# EAGLE design CC3200_V2.0 (EAGLE 6.6.0)
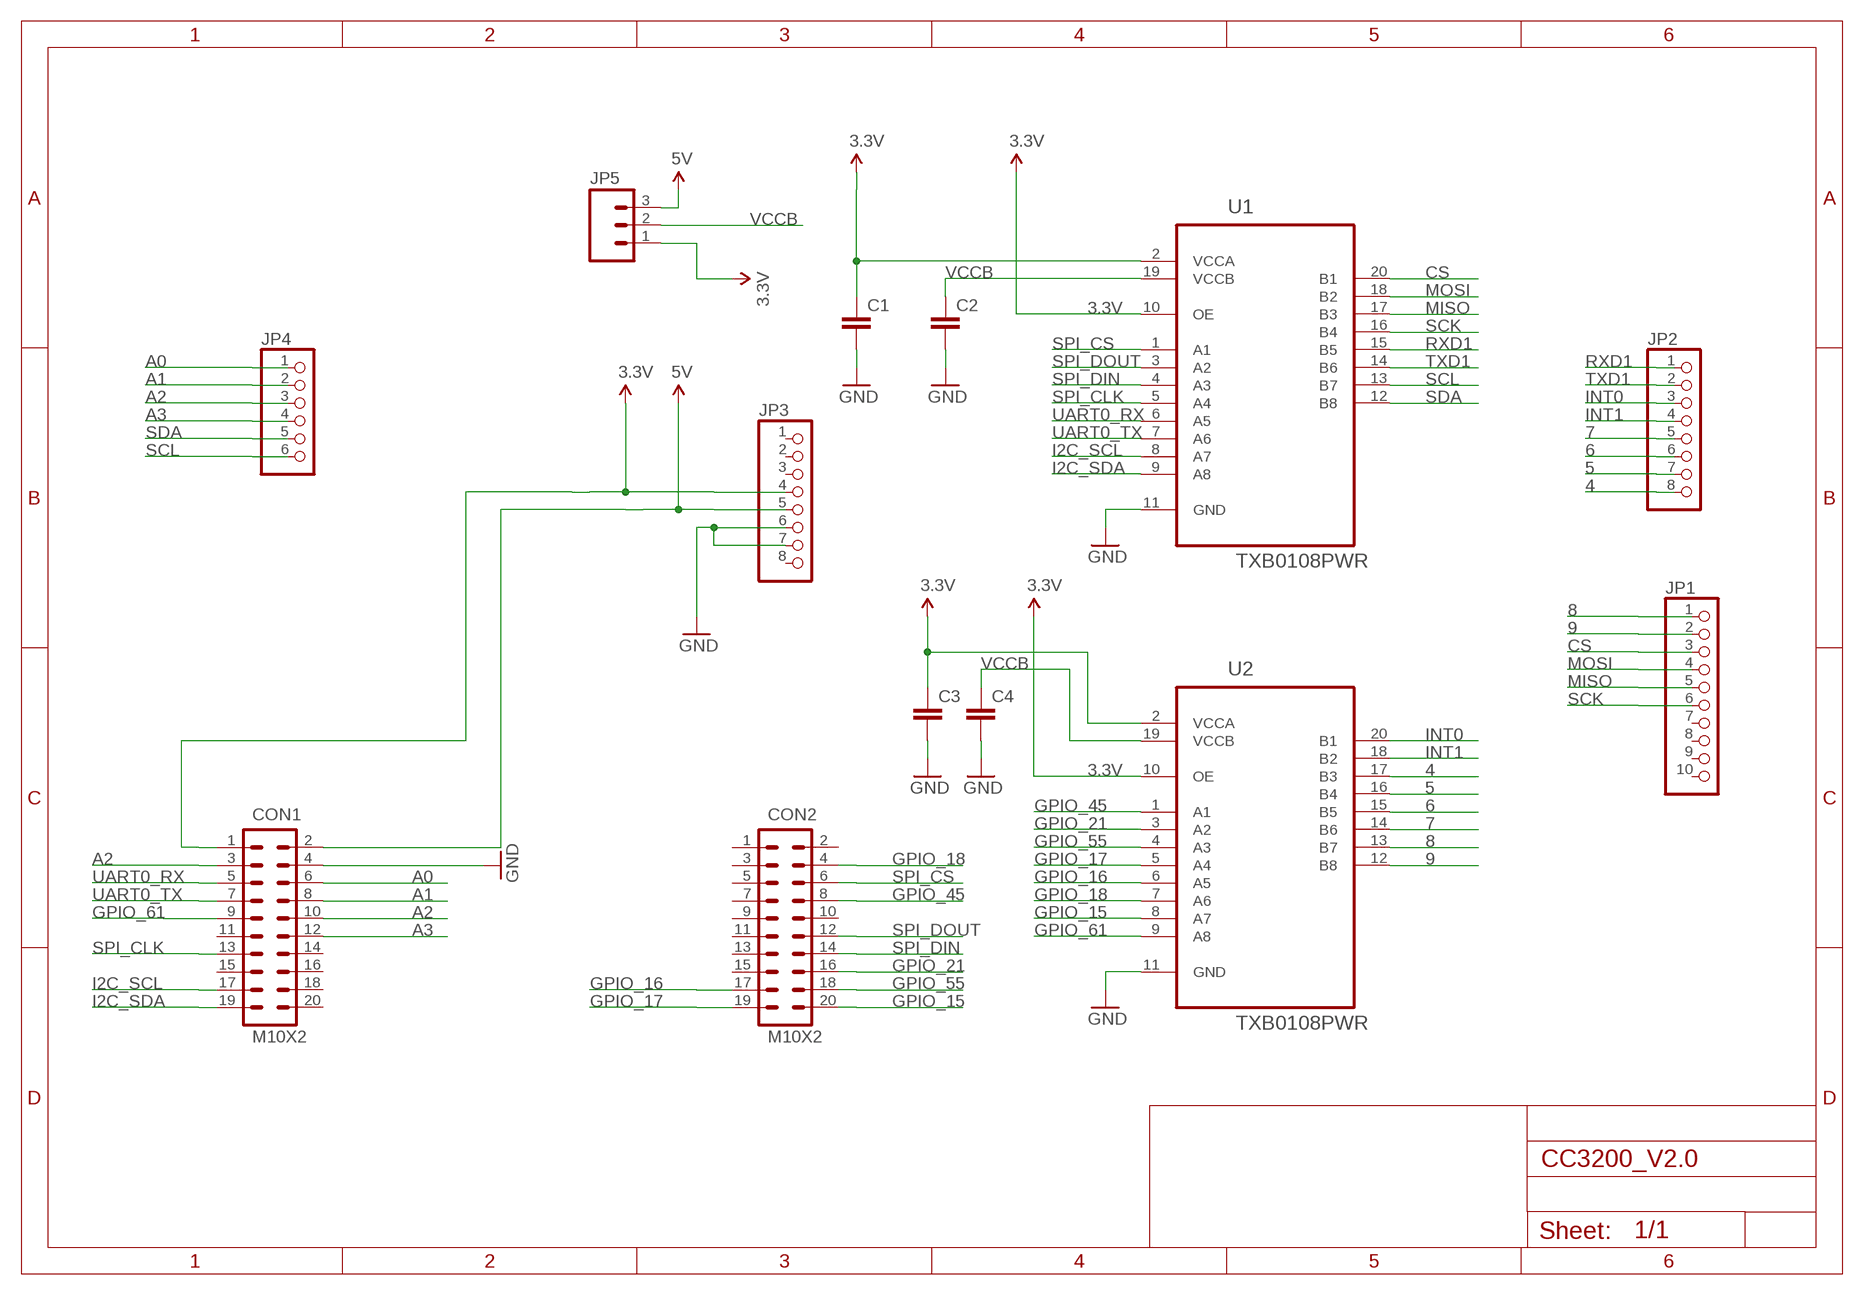
[diagram p0: schematic, sheet 1]

## Parts
C1  C-EUC0805  [C0805]
C2  C-EUC0805  [C0805]
C3  C-EUC0805  [C0805]
C4  C-EUC0805  [C0805]
CON1  M10X2  [2X10]
CON2  M10X2  [2X10]
JP1  PINHD-1X10_ARD  [1X10]
JP2  PINHD-1X8TH  [1X08-TH]
JP3  PINHD-1X8TH  [1X08-TH]
JP4  PINHD-1X6TH  [1X06-TH]
JP5  M03PTH  [1X03]
U1  TXB0108PWR  [SOP65P640X120-20N]
U2  TXB0108PWR  [SOP65P640X120-20N]

## Nets
3.3V: C1.1 C3.1 CON1.1 JP3.4 JP5.1 U1.2(VCCA) U1.10(OE) U2.2(VCCA) U2.10(OE)
4: JP2.8 U2.17(B3)
5: JP2.7 U2.16(B4)
5V: CON1.2 JP3.5 JP5.3
6: JP2.6 U2.15(B5)
7: JP2.5 U2.14(B6)
8: JP1.1 U2.13(B7)
9: JP1.2 U2.12(B8)
A0: CON1.6 JP4.1
A1: CON1.8 JP4.2
A2: CON1.3 CON1.10 JP4.3
A3: CON1.12 JP4.4
CS: JP1.3 U1.20(B1)
GND: C1.2 C2.2 C3.2 C4.2 CON1.4 JP3.6 JP3.7 U1.11(GND) U2.11(GND)
GPIO_15: CON2.20 U2.8(A7)
GPIO_16: CON2.17 U2.6(A5)
GPIO_17: CON2.19 U2.5(A4)
GPIO_18: CON2.4 U2.7(A6)
GPIO_21: CON2.16 U2.3(A2)
GPIO_45: CON2.8 U2.1(A1)
GPIO_55: CON2.18 U2.4(A3)
GPIO_61: CON1.9 U2.9(A8)
I2C_SCL: CON1.17 U1.8(A7)
I2C_SDA: CON1.19 U1.9(A8)
INT0: JP2.3 U2.20(B1)
INT1: JP2.4 U2.18(B2)
MISO: JP1.5 U1.17(B3)
MOSI: JP1.4 U1.18(B2)
RXD1: JP2.1 U1.15(B5)
SCK: JP1.6 U1.16(B4)
SCL: JP4.6 U1.13(B7)
SDA: JP4.5 U1.12(B8)
SPI_CLK: CON1.13 U1.5(A4)
SPI_CS: CON2.6 U1.1(A1)
SPI_DIN: CON2.14 U1.4(A3)
SPI_DOUT: CON2.12 U1.3(A2)
TXD1: JP2.2 U1.14(B6)
UART0_RX: CON1.5 U1.6(A5)
UART0_TX: CON1.7 U1.7(A6)
VCCB: C2.1 C4.1 JP5.2 U1.19(VCCB) U2.19(VCCB)
Unconnected: CON1.11 CON1.14 CON1.15 CON1.16 CON1.18 CON1.20 CON2.1 CON2.2 CON2.3 CON2.5 CON2.7 CON2.9 CON2.10 CON2.11 CON2.13 CON2.15 JP1.7 JP1.8 JP1.9 JP1.10 JP3.1 JP3.2 JP3.3 JP3.8

## Library data of the parts
C1-C4 = rcl:C-EU: CAPACITOR, European symbol
CON1 CON2 = SparkFun-Connectors:M10X2: This was SPECIALLY designed to be used with our Graphic LCD Backpack. Be sure you want to use this! It is not only staggered on each line of header holes, but IT IS ALSO offset of the center point of the top and bottom lines by 5 mil. This causes the headers to lock into place on the "standard" footprint on the LCD screen. The extra squares on the tdocu layer are there simply to reference other pins (if you were to actually populate a longer header than ten long - this is what we do with the backpacks).
JP1 = SmartPrj:PINHD-1X10_ARD: PIN HEADER
JP2 JP3 = SmartPrj:PINHD-1X8: PIN HEADER
JP4 = SmartPrj:PINHD-1X6: PIN HEADER
JP5 = SparkFun-Connectors:M03: Header 3 Standard 3-pin 0.1" header. Use with straight break away headers (SKU : PRT-00116), right angle break away headers (PRT-00553), swiss pins (PRT-00743), machine pins (PRT-00117), and female headers (PRT-00115). Molex polarized connector foot print use with SKU : PRT-08232 with associated crimp pins and housings.
U1 U2 = TXB0108PWR:TXB0108PWR: 8-BIT BIDIRECTIONAL VOLTAGE-LEVEL TRANSLATOR; MPN: TXB0108PWR; OC_FARNELL: 1494945; OC_NEWARK: 27M1151; PACKAGE: TSSOP-20; SUPPLIER: Texas Instruments

## Board
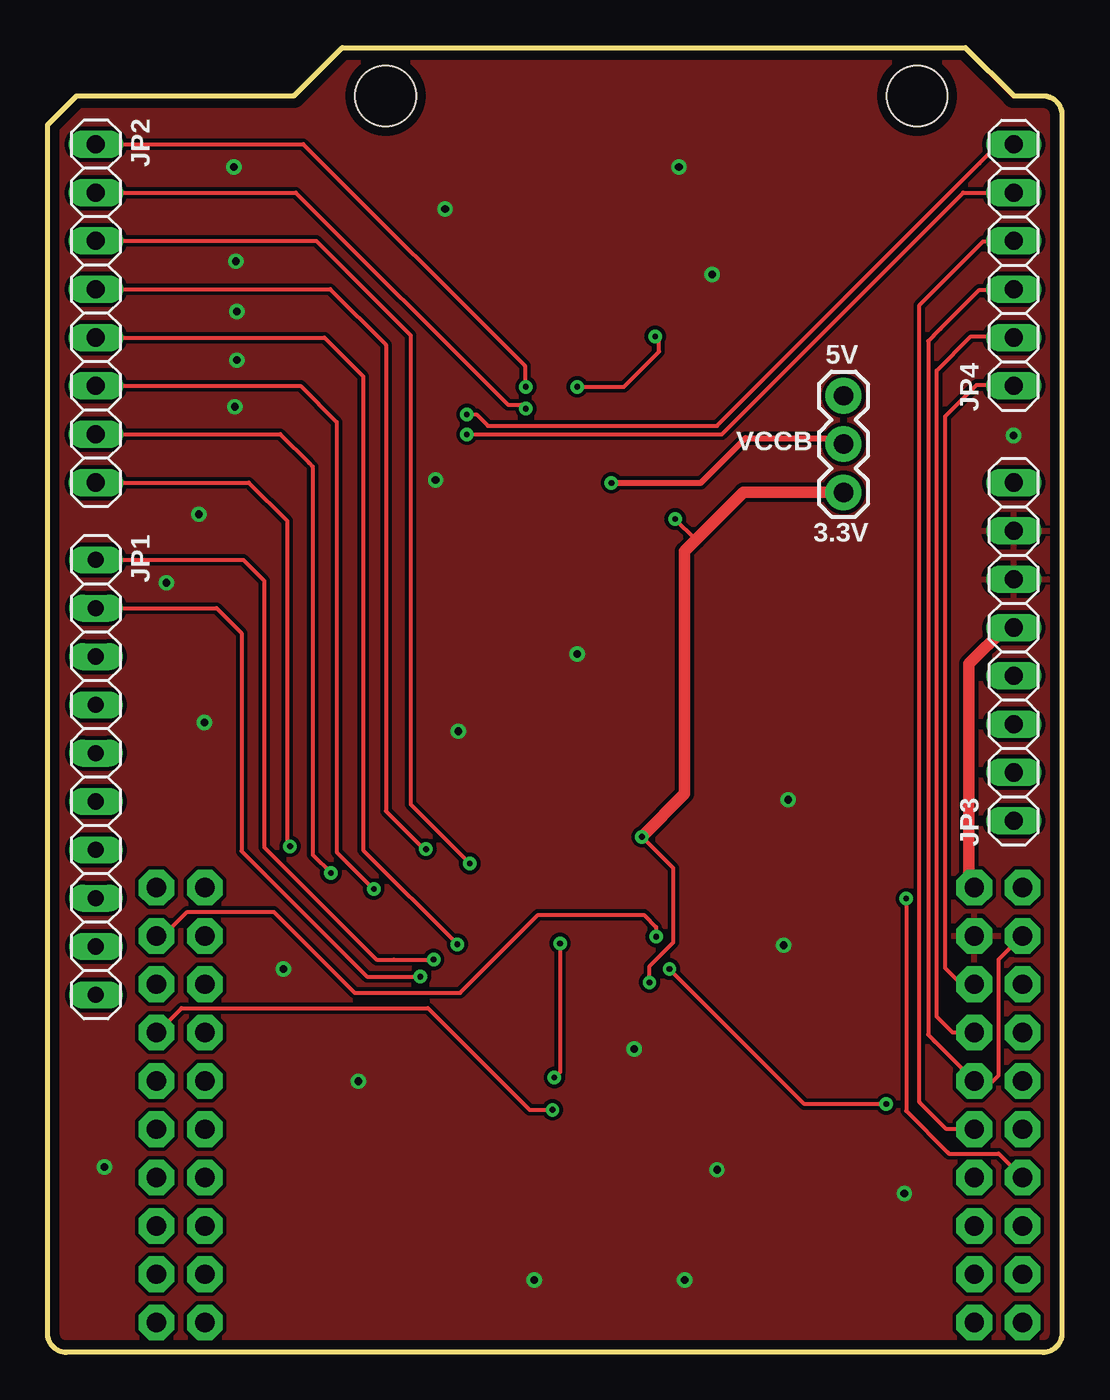
[diagram p1: board, top side]
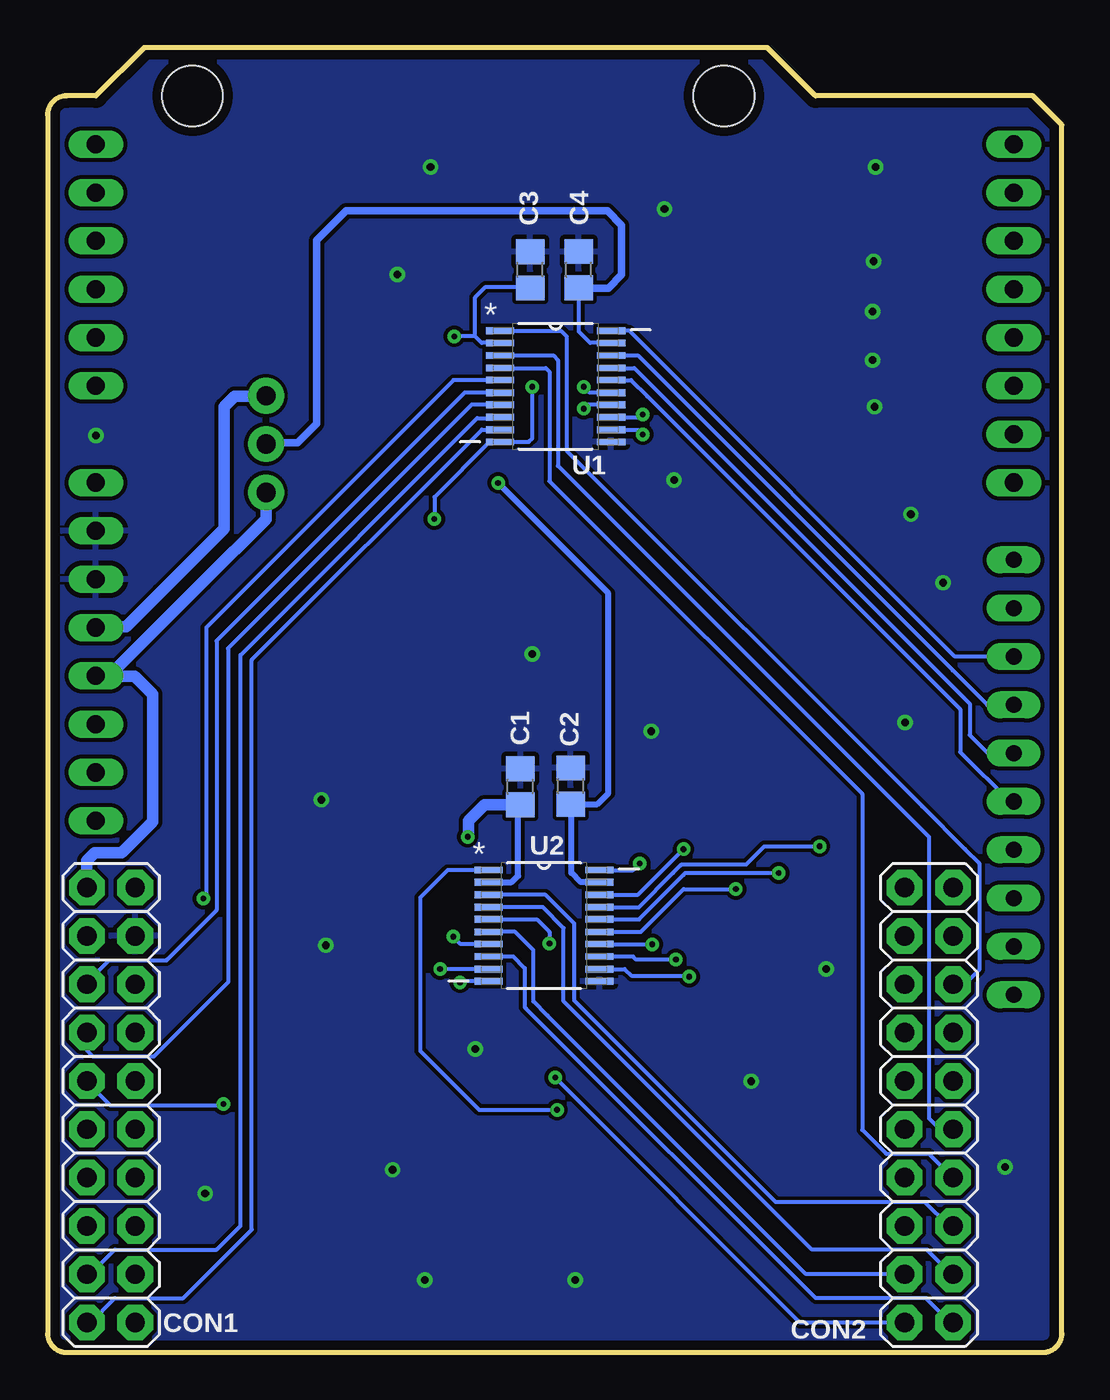
[diagram p2: board, bottom side, seen from below]

Size 53.34 x 68.58 mm. Coordinates in mm from the lower left corner, seen from the top.
Outline: 0,64.52 1.52,66.04 12.95,66.04 15.49,68.58 48.26,68.58 50.8,66.04 52.34,66.04 arc-90 53.34,65.04 53.34,1 arc-90 52.34,0 1,0 arc-90 0,1 0,64.52
Copper layers (1*16): Top 0.035mm / dielectric 1.5mm / Bottom 0.035mm
Design rules "default *": minimum track width 0.2mm, minimum drill 0.3mm, track to track 8mil, track to pad 8mil, pad to pad 8mil, via to via 8mil, smd to smd 8mil, copper to edge 0.5mm, drill to drill 0.5mm, minimum pad ring 10mil, minimum via ring 8mil, stop-mask expansion 4mil, vias tented up to drill 0mil, thermal gap 10mil
Holes 3.2 mm at 17.78,66.04 45.72,66.04

### Footprints (pad centres in the part's own frame; a part is rotated, then mirrored left to right if it is on the bottom)
C0805 = smd 1.3 x 1.5: 1 -0.95,0; 2 0.95,0
2X10 = drill 1.016 pad 1.88 octagon: 1 -11.43,-1.27; 2 -11.43,1.27; 3 -8.89,-1.27; 4 -8.89,1.27; 5 -6.35,-1.27; 6 -6.35,1.27; 7 -3.81,-1.27; 8 -3.81,1.27; 9 -1.27,-1.27; 10 -1.27,1.27; 11 1.27,-1.27; 12 1.27,1.27; 13 3.81,-1.27; 14 3.81,1.27; 15 6.35,-1.27; 16 6.35,1.27; 17 8.89,-1.27; 18 8.89,1.27; 19 11.43,-1.27; 20 11.43,1.27
1X10 = drill 0.85 pad 1.422 long: 1 -11.43,0; 2 -8.89,0; 3 -6.35,0; 4 -3.81,0; 5 -1.27,0; 6 1.27,0; 7 3.81,0; 8 6.35,0; 9 8.89,0; 10 11.43,0
1X08-TH = drill 0.95 pad 1.422 long: 1 -8.89,0; 2 -6.35,0; 3 -3.81,0; 4 -1.27,0; 5 1.27,0; 6 3.81,0; 7 6.35,0; 8 8.89,0
1X06-TH = drill 0.95 pad 1.422 long: 1 -6.35,0; 2 -3.81,0; 3 -1.27,0; 4 1.27,0; 5 3.81,0; 6 6.35,0
1X03 = drill 1.016 pad 1.88: 1 0,0; 2 2.54,0; 3 5.08,0
SOP65P640X120-20N = smd 1.473 x 0.356: 1 -2.921,2.921; 2 -2.921,2.286; 3 -2.921,1.626; 4 -2.921,0.965; 5 -2.921,0.33; 6 -2.921,-0.33; 7 -2.921,-0.965; 8 -2.921,-1.626; 9 -2.921,-2.286; 10 -2.921,-2.921; 11 2.921,-2.921; 12 2.921,-2.286; 13 2.921,-1.626; 14 2.921,-0.965; 15 2.921,-0.33; 16 2.921,0.33; 17 2.921,0.965; 18 2.921,1.626; 19 2.921,2.286; 20 2.921,2.921

### Placement (x,y rotation side)
C1  28.48,29.73 90 bottom
C2  25.83,29.77 90 bottom
C3  27.97,56.9 90 bottom
C4  25.42,56.91 90 bottom
CON1  50,13 270 bottom
CON2  7,13 270 bottom
JP1  2.54,30.23 270 top
JP2  2.54,54.61 270 top
JP3  50.8,36.83 90 top
JP4  50.8,57.15 90 top
JP5  41.85,45.2 90 top
U1  26.62,50.77 0 bottom
U2  27.24,22.43 0 bottom

### Tracks (layer width: path | path; a pad name or v marks a point on that pad's centre or on a via)
3.3V  (via drill 0.3)
  Top 0.2: 34.1,42.7 v33,43.8 | v27.85,50.75 30.3,50.75 32.15,52.6 32.15,53.2 v31.95,53.4 | v31.65,19.45 31.65,20.3 32.9,21.55 32.9,25.45 v31.25,27.1
  Top 0.61: JP5.1 36.6,45.2 34.1,42.7 33.5,42.1 33.5,29.35 v31.25,27.1
  Bottom 0.2: U1.2 30.51,53.06 30.85,53.4 | 30.85,53.4 30.85,55.45 30.3,56 28.02,56 C3.1 | v33,43.8 33,44.95 30.1,47.85 U1.10 28.05,47.85 27.85,48.05 v27.85,50.75 | 30.85,53.4 v31.95,53.4 | U2.10 31.59,19.51 v31.65,19.45
  Bottom 0.305: U2.2 28.93,24.72 28.6,25.05 28.6,28.66 C1.1
  Bottom 0.61: JP5.1 41.85,43.8 45.15,40.5 50.09,35.56 JP3.4 48.75,35.55 47.8,34.6 47.8,33.75 47.8,28.5 47.8,27.9 49.45,26.25 50.85,26.25 51.27,25.83 CON1.1 | C1.1 30.37,28.78 31.2,27.95 31.2,27.15 v31.25,27.1
4  (via drill 0.3)
  Top 0.2: JP2.8 10.58,45.72 12.6,43.7 12.6,26.75 v12.75,26.6
  Bottom 0.2: U2.17 22.25,23.4 20.45,25.2 20.05,25.6 20,25.65 16.6,25.65 15.65,26.6 v12.75,26.6
5  (via drill 0.3)
  Top 0.2: JP2.7 12.24,48.26 13.75,46.75 13.95,46.55 13.95,26.15 v14.9,25.2
  Bottom 0.2: U2.16 22.24,22.76 19.9,25.1 19.8,25.2 v14.9,25.2
5V
  Top 0.61: CON1.2 48.45,24.71 48.45,36.2 50.35,38.1 JP3.5
  Bottom 0.61: JP3.5 50.75,38.15 49.2,38.15 47.4,39.95 44.05,43.3 44.05,49.7 43.5,50.25 41.88,50.25 JP5.3
6  (via drill 0.3)
  Top 0.2: JP2.6 13.3,50.8 15.2,48.9 15.2,26.3 v17.15,24.35
  Bottom 0.2: U2.15 22.15,22.1 19.9,24.35 v17.15,24.35
7  (via drill 0.3)
  Top 0.2: JP2.5 14.56,53.34 16.6,51.3 16.6,26.4 v21.55,21.45
  Bottom 0.2: U2.14 21.57,21.47 v21.55,21.45
8  (via drill 0.3)
  Top 0.2: JP1.1 10.29,41.66 11.4,40.55 11.4,27.45 11.4,26.55 17.3,20.65 18.2,20.65 v20.3,20.65
  Bottom 0.2: v20.3,20.65 22.4,20.65 22.55,20.8 U2.13
9  (via drill 0.3)
  Top 0.2: JP1.2 8.88,39.12 10.2,37.8 10.2,26.35 16.8,19.75 v19.6,19.75
  Bottom 0.2: U2.12 23,20.14 22.65,19.8 19.65,19.8 v19.6,19.75
A0
  Top 0.2: CON1.6 48.05,19.35 47.2,20.2 47.2,49.2 48.85,50.85 50.75,50.85 JP4.1
A1
  Top 0.2: CON1.8 47.59,16.81 46.75,17.65 46.75,51.6 48.55,53.4 50.74,53.4 JP4.2
A2
  Top 0.2: 46.67,16.32 CON1.10 48.75,14.25 49.7,14.25 50,14.55 50,20.65 51.24,21.89 CON1.3 | 46.67,16.32 46.6,16.4 | 46.6,53.45 46.95,53.8 | 46.95,53.8 49,55.85 50.77,55.85 JP4.3 | 46.95,53.8 46.3,53.15 46.3,16.7 46.67,16.32
A3
  Top 0.2: CON1.12 47.27,11.73 45.85,13.15 45.85,55.05 49.2,58.4 50.78,58.4 JP4.4
CS
  Bottom 0.2: JP1.3 5.63,36.58 22.75,53.7 U1.20
GND  (via drill 0.4)
  other vias: 33.2,62.3 34.95,56.65 20.9,60.1 20.4,45.85 27.85,36.7 38.95,29.05 35.2,9.6 16.35,14.25 9.95,54.7 9.8,62.3 9.9,57.35 9.95,52.15 9.85,49.7 7.95,44.05 8.25,33.1 6.25,40.45 12.4,20.15 21.6,32.65 50.8,48.2 38.7,21.4 25.6,3.8 33.5,3.8 30.85,15.95 45.05,8.35 3,9.75
  pour Bottom: -2,72 55,72 55,-2 -2,-2
  pour Top: -2,70 55,70 55,-2 -2,-2
GPIO_15
  Bottom 0.2: CON2.20 5.87,1.57 7.15,2.85 12.95,2.85 28.2,18.1 28.25,18.15 28.25,20.2 28.85,20.8 U2.8
GPIO_16
  Bottom 0.2: CON2.17 13.46,4.11 27.05,17.7 27.8,18.45 27.8,21.15 28.75,22.1 U2.6
GPIO_17  (via drill 0.3)
  Top 0.2: v26.95,21.5 26.95,14.75 v26.65,14.45
  Bottom 0.2: U2.5 27.61,22.76 26.95,22.1 v26.95,21.5 | CON2.19 13.77,1.57 v26.65,14.45
GPIO_18  (via drill 0.3)
  Top 0.2: CON2.4 6.09,21.89 7.35,23.15 11.9,23.15 16.15,18.9 21.7,18.9 25.8,23 31.35,23 32,22.35 v32,21.85
  Bottom 0.2: U2.7 31.62,21.47 v32,21.85
GPIO_21
  Bottom 0.2: CON2.16 5.95,6.65 7.2,7.9 15.05,7.9 25.07,17.93 25.65,18.5 25.65,22.55 25.8,22.7 27.15,24.05 U2.3
GPIO_45  (via drill 0.3)
  Top 0.2: CON2.8 5.76,16.81 7.05,18.1 20,18.1 25.35,12.75 v26.55,12.75
  Bottom 0.2: U2.1 32.3,25.35 33.75,23.9 33.75,15.85 30.65,12.75 v26.55,12.75
GPIO_55
  Bottom 0.2: CON2.18 5.81,4.11 7.1,5.4 13.15,5.4 26.15,18.4 26.2,18.45 26.2,22.3 27.3,23.4 U2.4
GPIO_61  (via drill 0.3)
  Top 0.2: v44.1,13.05 39.8,13.05 v32.7,20.15
  Bottom 0.2: CON1.9 51.27,14.22 50.05,13 44.15,13 v44.1,13.05 | U2.9 v32.7,20.14 v32.7,20.15
I2C_SCL
  Bottom 0.2: CON1.17 51.09,4.11 49.8,5.4 44.45,5.4 43.2,6.65 43.2,36.65 30.75,49.1 29.59,49.1 U1.8
I2C_SDA
  Bottom 0.2: CON1.19 51.08,1.57 49.8,2.85 46.2,2.85 42.6,6.45 42.6,36.4 30.5,48.5 29.56,48.5 U1.9
INT0  (via drill 0.3)
  Top 0.2: JP2.3 13.58,58.42 14.13,58.42 18.65,53.9 19.1,53.45 19.1,28.8 19.12,28.77 v22.2,25.7
  Bottom 0.2: U2.20 22.55,25.35 v22.2,25.7
INT1  (via drill 0.3)
  Top 0.2: JP2.4 14.87,55.88 17.8,52.95 17.8,28.45 19.8,26.45 v19.9,26.45
  Bottom 0.2: U2.18 22.29,24.06 v19.9,26.45
MISO
  Bottom 0.2: U1.17 22.49,51.74 4.85,34.1 4.85,32.45 3.9,31.5 JP1.5
MOSI
  Bottom 0.2: U1.18 22.3,52.4 5.75,35.85 3.94,34.04 JP1.4
RXD1  (via drill 0.3)
  Top 0.2: JP2.1 13.45,63.5 25.1,51.85 25.1,50.8 v25.15,50.75
  Bottom 0.2: U1.15 24.84,50.44 v25.15,50.75
SCK
  Bottom 0.2: U1.16 22.65,51.1 21.8,50.25 5.35,33.8 5.35,31.55 2.76,28.96 JP1.6
SCL  (via drill 0.3)
  Top 0.2: v22.05,49.3 22.55,49.3 23.15,48.7 35.2,48.7 49,62.5 50,63.5 JP4.6
  Bottom 0.2: U1.13 22.2,49.15 v22.05,49.3
SDA  (via drill 0.3)
  Top 0.2: v22.05,48.25 35.45,48.25 48.15,60.95 JP4.5
  Bottom 0.2: U1.12 22.29,48.49 v22.05,48.25
SPI_CLK  (via drill 0.3)
  Top 0.2: v45.15,23.85 45.15,12.7 47.35,10.5 47.4,10.45 50.01,10.45 CON1.13
  Bottom 0.2: U1.5 32,51.1 45,38.1 45,24 v45.15,23.85
SPI_CS
  Bottom 0.2: U1.1 26.34,53.69 26.05,53.4 26.05,47.4 7.35,28.7 5.1,26.45 4.35,25.7 4.35,20.1 5.1,19.35 CON2.6
SPI_DIN
  Bottom 0.2: U1.4 27.14,51.74 26.95,51.55 26.95,45.8 10.5,29.35 10.5,11.7 9.3,10.5 9.25,10.45 6.99,10.45 CON2.14
SPI_DOUT
  Bottom 0.2: U1.3 26.75,52.4 26.5,52.15 26.5,46.6 7.1,27.2 7,27.1 7,12.3 6.4,11.7 5.76,11.7 CON2.12
TXD1  (via drill 0.3)
  Top 0.2: JP2.2 13.05,60.96 24.2,49.81 24.94,49.81 v25.15,49.6
  Bottom 0.2: U1.14 24.94,49.81 v25.15,49.6
UART0_RX
  Bottom 0.2: U1.6 31.41,50.44 44.45,37.4 44.45,23.25 47.05,20.65 47.1,20.6 50.1,20.6 51.27,19.43 CON1.5
UART0_TX
  Bottom 0.2: U1.7 31.04,49.81 43.85,37 43.85,19.45 47.75,15.55 50.95,15.55 51.25,15.85 51.25,16.79 CON1.7
VCCB  (via drill 0.3)
  Top 0.305: v29.65,45.7 34.35,45.7 36.7,48.05 41.54,48.05 JP5.2
  Bottom 0.2: U1.19 24.81,53.06 25.4,53.65 25.4,55.94 | 25.4,55.94 C4.1 25.4,55.94
  Bottom 0.305: U2.19 25.32,24.72 25.8,25.2 25.8,28.79 C2.1 24.43,28.82 23.85,29.4 23.85,39.9 v29.65,45.7
  Bottom 0.406: 25.4,55.94 23.86,55.94 23.15,56.65 23.15,59.25 23.9,60 37.65,60 39.2,58.45 39.2,48.8 40.2,47.8 41.79,47.8 JP5.2

### Text on the board
tPlace: 5V | VCCB | 3.3V